# Altium schematic sheet SingleCycleCPU.SchDoc
size 281 x 215 mm
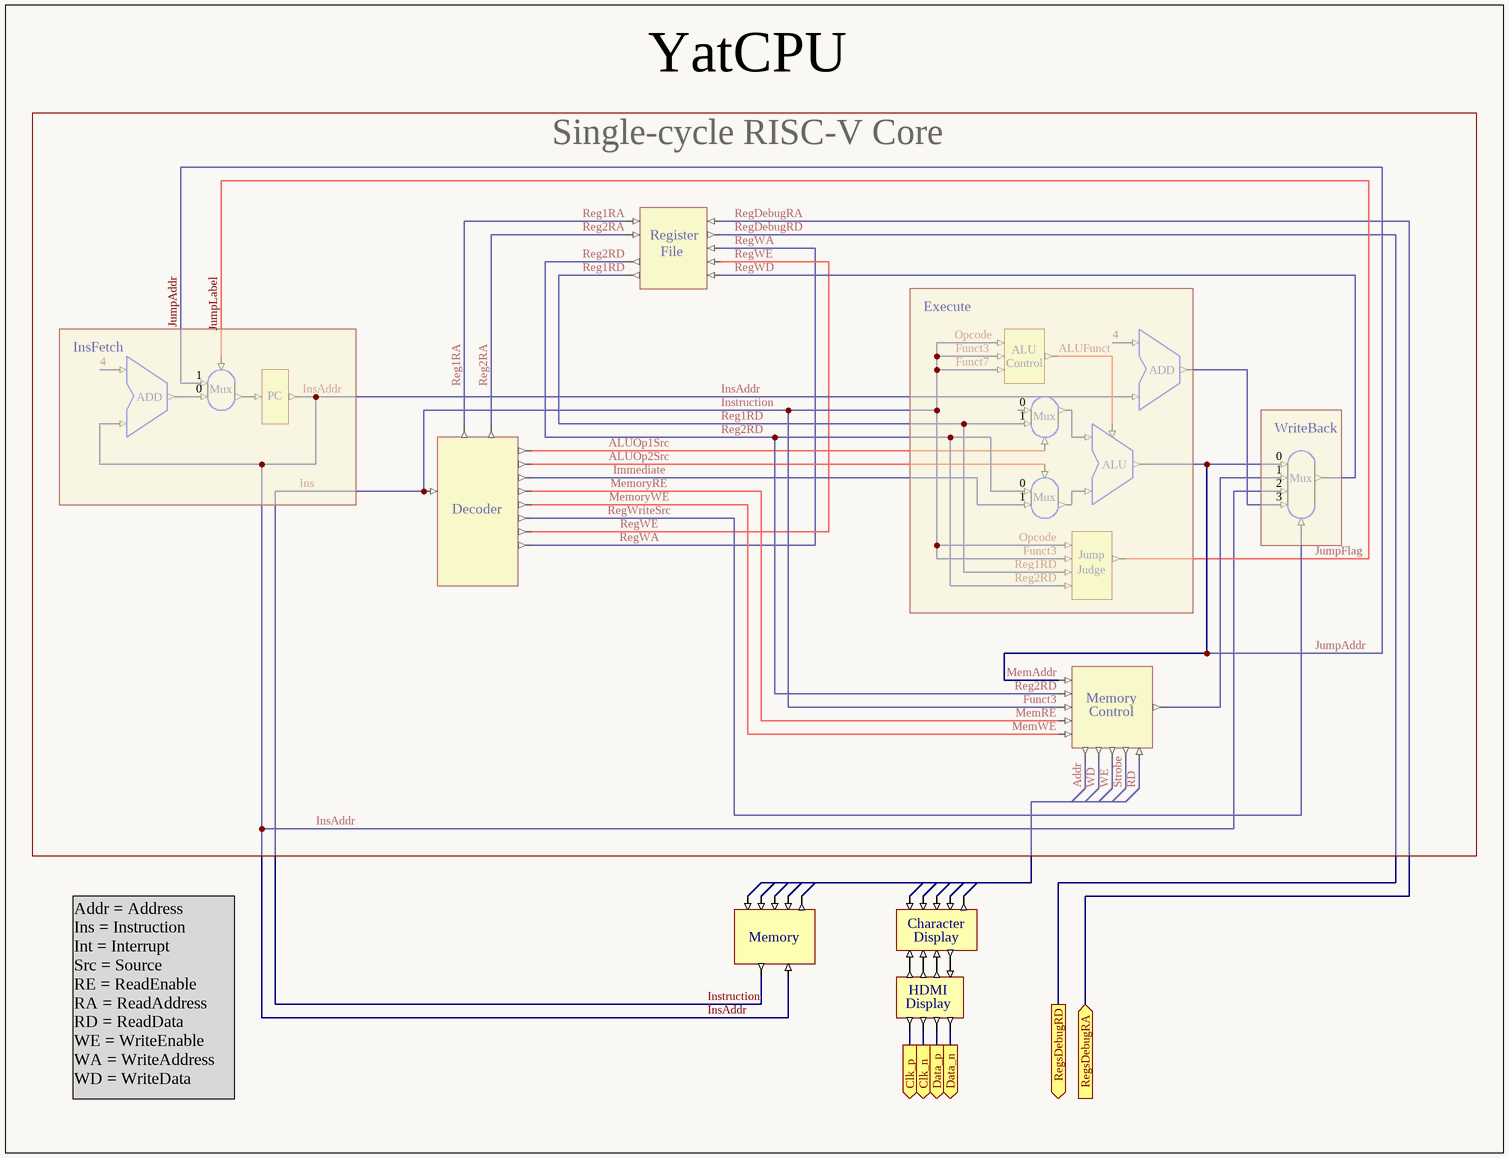
[diagram p0: SingleCycleCPU.SchDoc]

## Parts
(Parts that share a designator on the sheet are numbered #1, #2 ... from top to bottom, then left to right.)
*#1  RegFile  (value not drawn)
*#2  ALUControl  (value not drawn)
*#3  ADD  (value not drawn)
*#4  ADD  (value not drawn)
*#5  Mux2  (value not drawn)
*#6  Mux2‘  (value not drawn)
*#7  ALU  (value not drawn)
*#8  Mux4  (value not drawn)
*#9  JumpJudge  (value not drawn)
*#10  MemoryControl  (value not drawn)
*#11  Memory  (value not drawn)
*#12  CharacterDisplay  (value not drawn)
*#13  HDMIDisplay  (value not drawn)
*?  Mux2  (value not drawn)
ID  ID  (value not drawn)
Reg1  PC

## Blocks framed on the sheet
Single-cycle RISC-V Core: *#1-*#10 *? ID Reg1

## Ports
Clk_n (out), Clk_p (out), Data_n (out), Data_p (out), RegsDebugRA (in), RegsDebugRD (out)

## Nets
4: *#3.0(in0) *#4.0(in0)
Addr: *#10.10
ALUFunct: *#2.41 *#7.3
ALUOp1Src: *#6.3(select) ID.22
ALUOp2Src: *?.3(select) ID.14
Clk_n: *#13.47 ; port Clk_n
Clk_p: *#13.46 ; port Clk_p
Data_n: *#13.45 ; port Data_n
Data_p: *#13.48 ; port Data_p
Funct3: *#2.38 *#2.39 *#2.40 *#9.38 *#9.39 *#10.6 *#11.45 ID.11  [also labelled Funct7, Ins, Instruction, Opcode]
Immediate: *?.1(in1) ID.15
InsAddr: *#3.1(in1) *#4.1(in1) *#8.2(in1) *#11.46 Reg1.1(OUT)
JumpAddr: *#5.1(in0) *#7.2(out) *#8.0(in0) *#10.4  [also labelled MemAddr]
JumpFlag: *#5.3(select) *#9.40  [also labelled JumpLabel]
MemoryRE: *#10.7 ID.16  [also labelled MemRE]
MemoryWE: *#10.8 ID.17  [also labelled MemWE]
RD: *#10.13
Reg1RA: *#1.28 ID.12
Reg1RD: *#1.31 *#6.1(in1) *#9.36
Reg2RA: *#1.29 ID.13
Reg2RD: *#1.30 *#9.37 *#10.5 *?.0(in0)
RegDebugRA: *#1.35 ; port RegsDebugRA
RegDebugRD: *#1.36 ; port RegsDebugRD
RegWA: *#1.32 ID.20
RegWD: *#1.34 *#8.4(out)
RegWE: *#1.33 ID.19
RegWriteSrc: *#8.5(select) ID.18
Strobe: *#10.11
WD: *#10.14
WE: *#10.12
Net*#3_2: *#3.2(out) *#8.3(in3)
Net*#4_2: *#4.2(out) *#5.0(in1)
Net*#5_2: *#5.2(out) Reg1.0(IN)
Net*#6_2: *#6.2(out) *#7.0(in0)
Net*#7_1: *#7.1(in1) *?.2(out)
Net*#8_1: *#8.1(in1) *#10.9
Net*#12_45: *#12.45 *#13.44
Net*#12_46: *#12.46 *#13.43
Net*#12_47: *#12.47 *#13.43
Net*#12_48: *#12.48 *#13.43

Not connected (* = marked no-connect by the designer): *#6 0(in0); *#11 43 44; *#12 43 44; ID 21 23

## Notes on the sheet
- YatCPU
- Addr = Address
  Ins = Instruction
  Int = Interrupt
  Src = Source
  RE = ReadEnable
  RA = ReadAddress
  RD = ReadData
  WE = WriteEnable
  WA = WriteAddress
  WD = WriteData
- Labels drawn without touching a wire or pin: Execute, InsFetch, Opcode, WriteBack
- (in symbol ALUControl) ALU; Control
- (in symbol CharacterDisplay) Character; Display
- (in symbol HDMIDisplay) HDMI; Display
- (in symbol ID) Decoder
- (in symbol JumpJudge) Jump; Judge
- (in symbol MemoryControl) Memory; Control
- (in symbol Mux2) Mux
- (in symbol Mux2‘) Mux
- (in symbol Mux4) Mux
- (in symbol RegFile) Register; File

## Library data of the parts
Reg1 = Reg